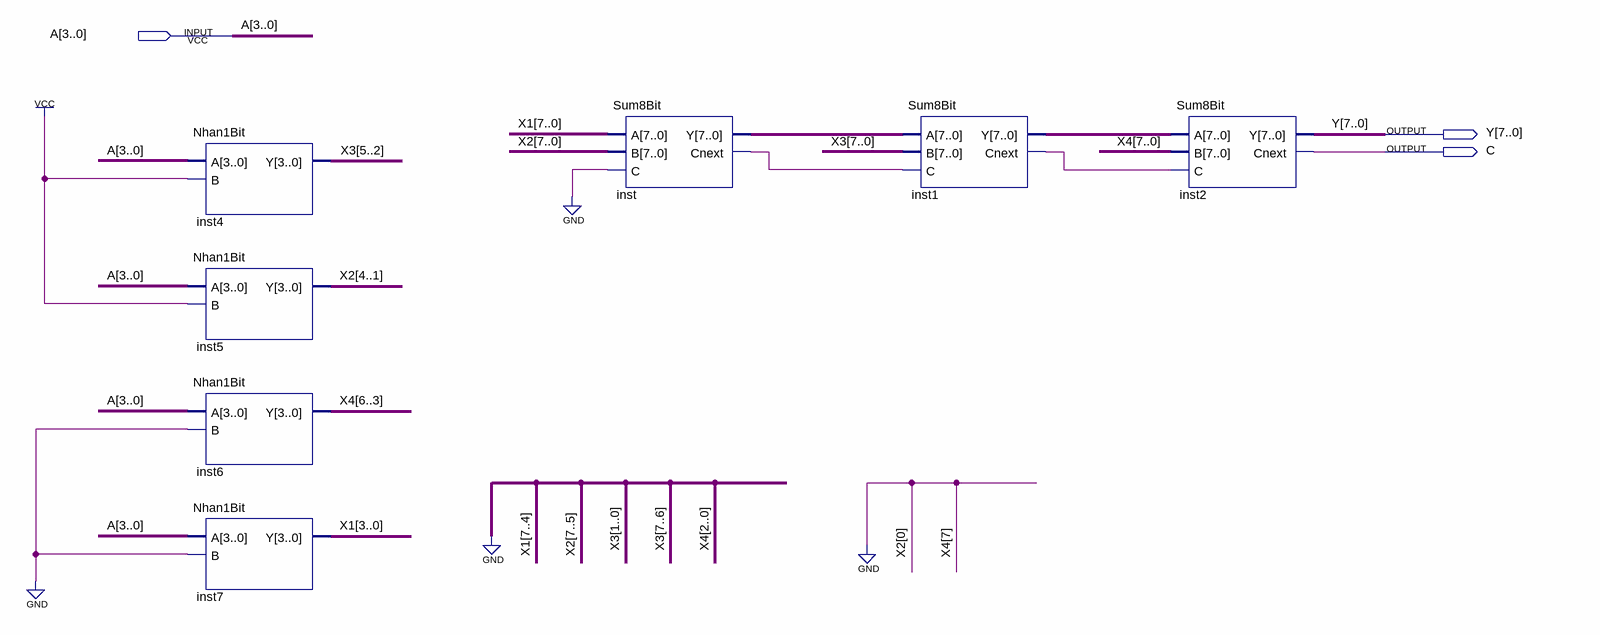
[diagram p0: schematic sheet]
// Quartus schematic Nhan4Bit.bdf as structural Verilog: 7 symbols, 3 pins
module Nhan4Bit (
  input  [3:0] A,
  output [7:0] Y,
  output C
);

  wire inst1_cnext, inst_cnext;
  wire [3:0] X1;
  wire [6:0] X4;
  wire [7:0] inst1_y, inst_y, X3;
  wire [7:1] X2;

  Nhan1Bit inst4 (.A(A), .B(1'b1), .Y(X3[5:2]));
  Nhan1Bit inst5 (.A(A), .B(1'b1), .Y(X2[4:1]));
  Nhan1Bit inst6 (.A(A), .B(1'b0), .Y(X4[6:3]));
  Nhan1Bit inst7 (.A(A), .B(1'b0), .Y(X1));
  Sum8Bit inst (.A({4'b0000, X1}), .B({X2, 1'b0}), .C(1'b0), .Y(inst_y), .Cnext(inst_cnext));
  Sum8Bit inst1 (.A(inst_y), .B(X3), .C(inst_cnext), .Y(inst1_y), .Cnext(inst1_cnext));
  Sum8Bit inst2 (.A(inst1_y), .B({1'b0, X4}), .C(inst1_cnext), .Y(Y), .Cnext(C));
endmodule
